# Altium schematic sheet RAM_DDR3_2RANK_BGA96.SchDoc
size A3
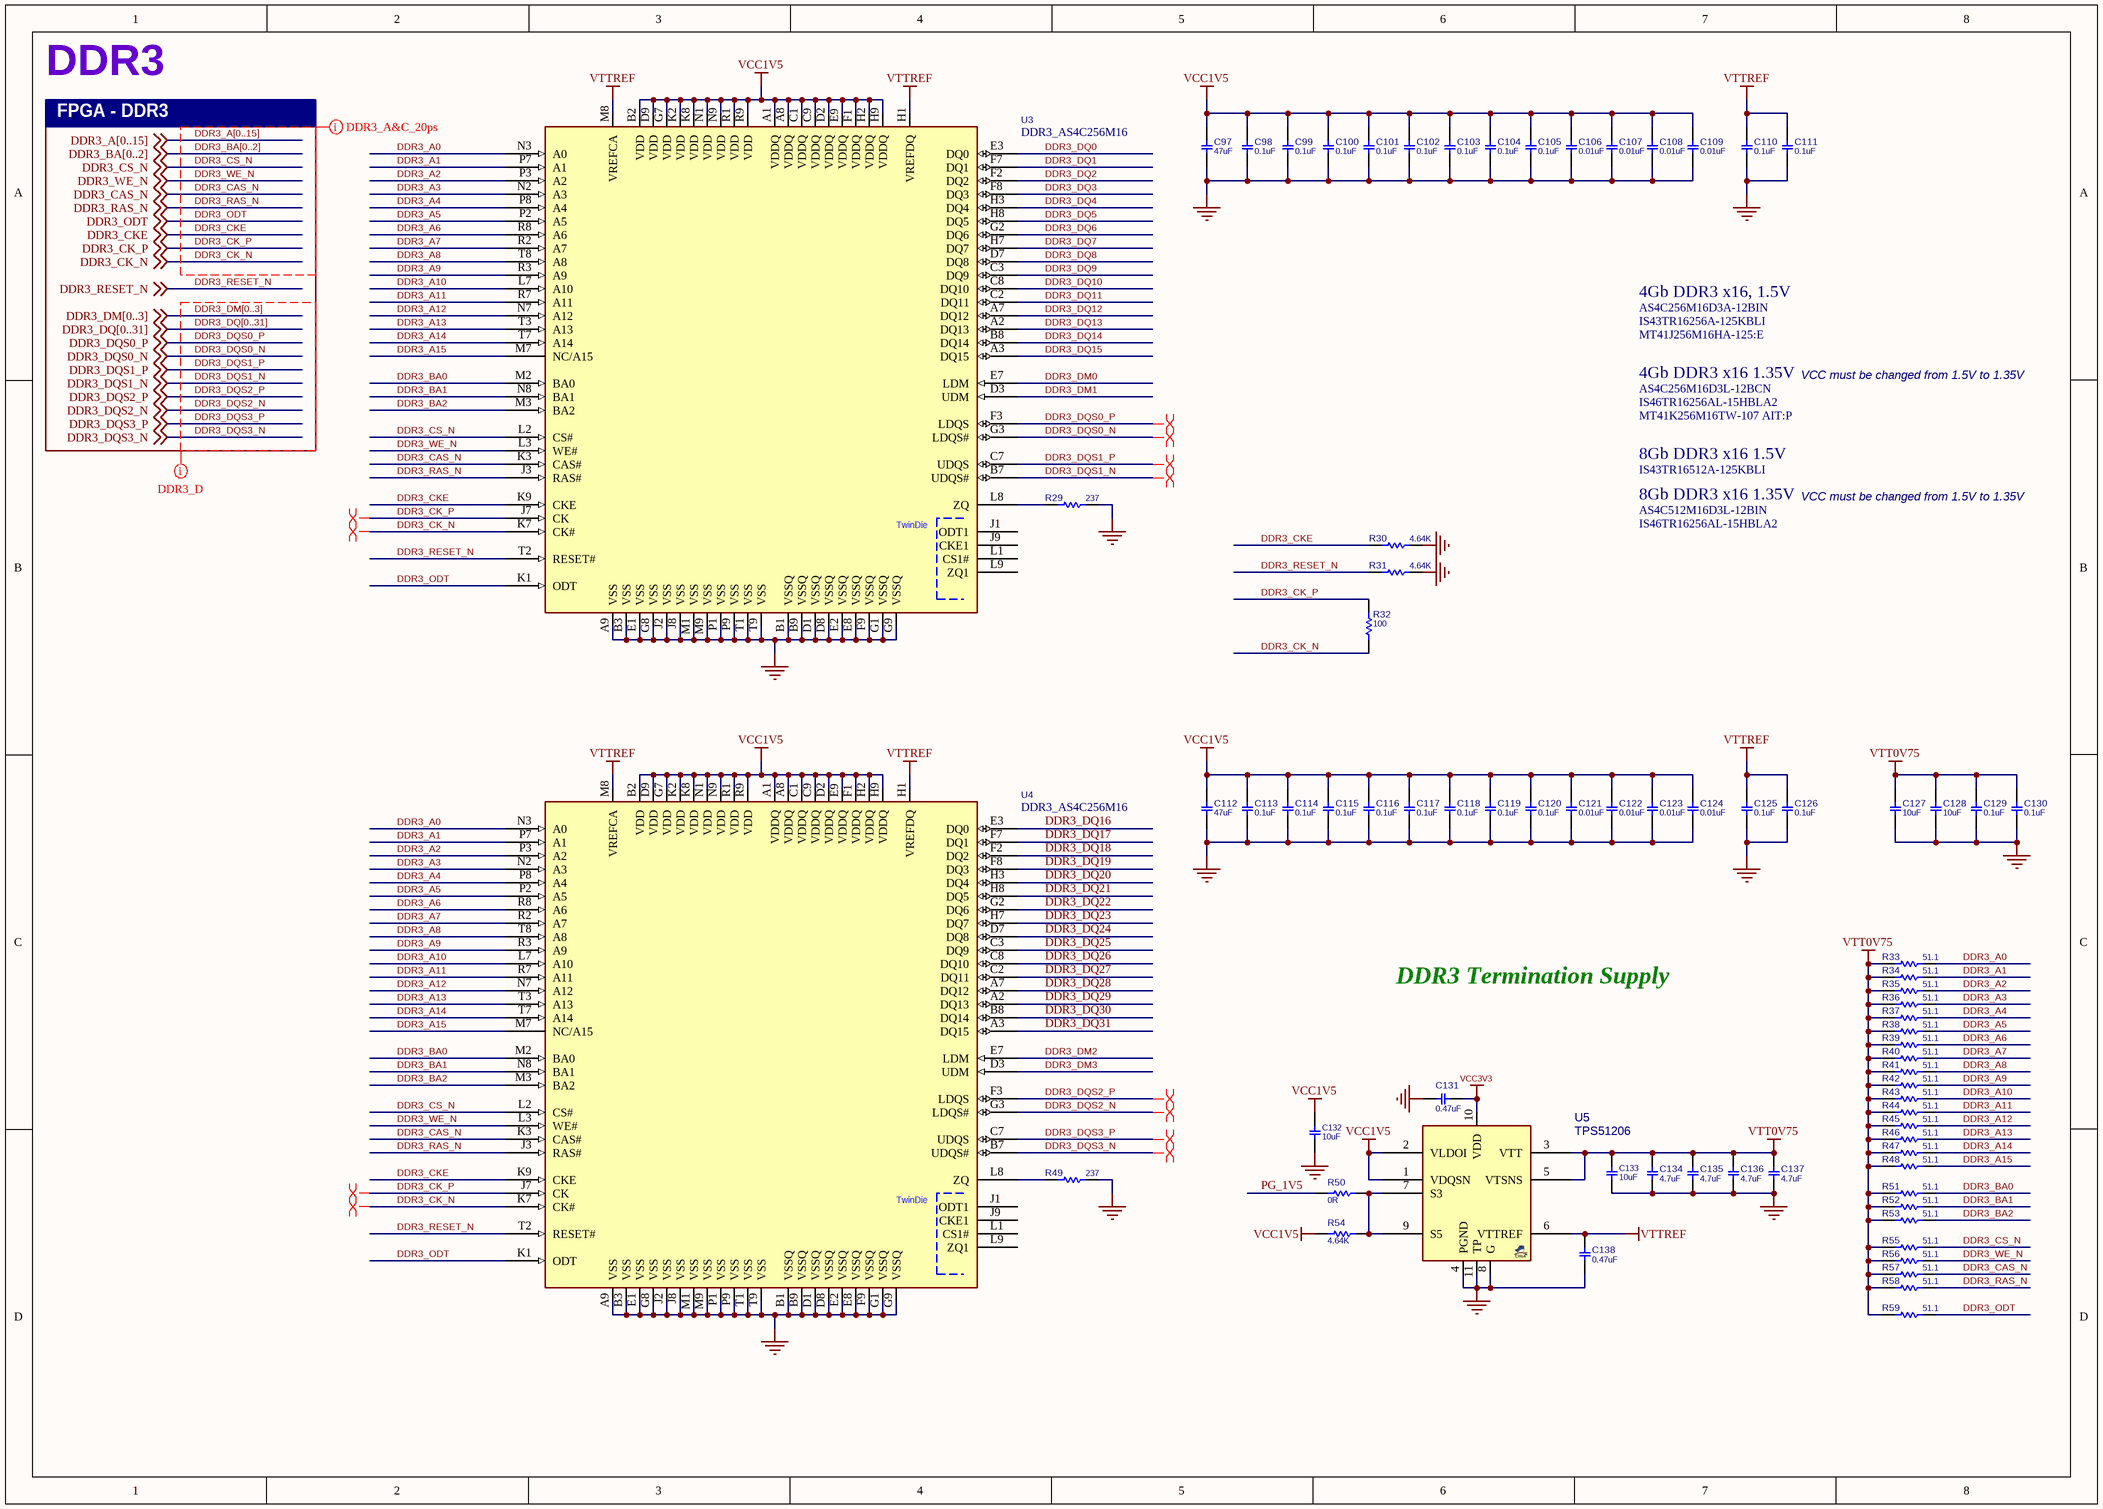
[diagram p0: RAM_DDR3_2RANK_BGA96.SchDoc]

## Parts
C97  47uF  [C0805]
C98  0.1uF  [C0402]
C99  0.1uF  [C0402]
C100  0.1uF  [C0402]
C101  0.1uF  [C0402]
C102  0.1uF  [C0402]
C103  0.1uF  [C0402]
C104  0.1uF  [C0402]
C105  0.1uF  [C0402]
C106  0.01uF  [C0402]
C107  0.01uF  [C0402]
C108  0.01uF  [C0402]
C109  0.01uF  [C0402]
C110  0.1uF  [C0402]
C111  0.1uF  [C0402]
C112  47uF  [C0805]
C113  0.1uF  [C0402]
C114  0.1uF  [C0402]
C115  0.1uF  [C0402]
C116  0.1uF  [C0402]
C117  0.1uF  [C0402]
C118  0.1uF  [C0402]
C119  0.1uF  [C0402]
C120  0.1uF  [C0402]
C121  0.01uF  [C0402]
C122  0.01uF  [C0402]
C123  0.01uF  [C0402]
C124  0.01uF  [C0402]
C125  0.1uF  [C0402]
C126  0.1uF  [C0402]
C127  10uF  [C0603]
C128  10uF  [C0603]
C129  0.1uF  [C0402A]
C130  0.1uF  [C0402A]
C131  0.47uF  [C0402]
C132  10uF  [C0603]
C133  10uF  [C0603]
C134  4.7uF  [C0603]
C135  4.7uF  [C0603]
C136  4.7uF  [C0603]
C137  4.7uF  [C0603]
C138  0.47uF  [C0402]
R29  237  [R0402]
R30  4.64K  [R0402]
R31  4.64K  [R0402]
R32  100  [R0402A]
R33  51.1  [R0402A]
R34  51.1  [R0402A]
R35  51.1  [R0402A]
R36  51.1  [R0402A]
R37  51.1  [R0402A]
R38  51.1  [R0402A]
R39  51.1  [R0402A]
R40  51.1  [R0402A]
R41  51.1  [R0402A]
R42  51.1  [R0402A]
R43  51.1  [R0402A]
R44  51.1  [R0402A]
R45  51.1  [R0402A]
R46  51.1  [R0402A]
R47  51.1  [R0402A]
R48  51.1  [R0402A]
R49  237  [R0402]
R50  0R  [R0402]
R51  51.1  [R0402A]
R52  51.1  [R0402A]
R53  51.1  [R0402A]
R54  4.64K  [R0402]
R55  51.1  [R0402A]
R56  51.1  [R0402A]
R57  51.1  [R0402A]
R58  51.1  [R0402A]
R59  51.1  [R0402A]
U3  DDR3_AS4C256M16  [BGA80_96_9X16B]
U4  DDR3_AS4C256M16  [BGA80_96_9X16B]
U5  TPS51206  [SON40_10T_2020]

## Nets
GND: C97.1 C98.1 C99.1 C100.1 C101.1 C102.1 C103.1 C104.1 C105.1 C106.1 C107.1 C108.1 C109.1 C110.1 C111.1 C112.1 C113.1 C114.1 C115.1 C116.1 C117.1 C118.1 C119.1 C120.1 C121.1 C122.1 C123.1 C124.1 C125.1 C126.1 C127.1 C128.1 C129.1 C130.1 C131.2 C132.1 C133.1 C134.2 C135.2 C136.2 C137.2 C138.2 R29.2 R30.2 R31.2 R49.2 U3.A9(VSS) U3.B1(VSSQ) U3.B3(VSS) U3.B9(VSSQ) U3.D1(VSSQ) U3.D8(VSSQ) U3.E1(VSS) U3.E2(VSSQ) U3.E8(VSSQ) U3.F9(VSSQ) U3.G1(VSSQ) U3.G8(VSS) U3.G9(VSSQ) U3.J2(VSS) U3.J8(VSS) U3.M1(VSS) U3.M9(VSS) U3.P1(VSS) U3.P9(VSS) U3.T1(VSS) U3.T9(VSS) U4.A9(VSS) U4.B1(VSSQ) U4.B3(VSS) U4.B9(VSSQ) U4.D1(VSSQ) U4.D8(VSSQ) U4.E1(VSS) U4.E2(VSSQ) U4.E8(VSSQ) U4.F9(VSSQ) U4.G1(VSSQ) U4.G8(VSS) U4.G9(VSSQ) U4.J2(VSS) U4.J8(VSS) U4.M1(VSS) U4.M9(VSS) U4.P1(VSS) U4.P9(VSS) U4.T1(VSS) U4.T9(VSS) U5.4(PGND) U5.8(G) U5.11(TP)
VCC1V5: C97.2 C98.2 C99.2 C100.2 C101.2 C102.2 C103.2 C104.2 C105.2 C106.2 C107.2 C108.2 C109.2 C112.2 C113.2 C114.2 C115.2 C116.2 C117.2 C118.2 C119.2 C120.2 C121.2 C122.2 C123.2 C124.2 C132.2 R54.1 U3.A1(VDDQ) U3.A8(VDDQ) U3.B2(VDD) U3.C1(VDDQ) U3.C9(VDDQ) U3.D2(VDDQ) U3.D9(VDD) U3.E9(VDDQ) U3.F1(VDDQ) U3.G7(VDD) U3.H2(VDDQ) U3.H9(VDDQ) U3.K2(VDD) U3.K8(VDD) U3.N1(VDD) U3.N9(VDD) U3.R1(VDD) U3.R9(VDD) U4.A1(VDDQ) U4.A8(VDDQ) U4.B2(VDD) U4.C1(VDDQ) U4.C9(VDDQ) U4.D2(VDDQ) U4.D9(VDD) U4.E9(VDDQ) U4.F1(VDDQ) U4.G7(VDD) U4.H2(VDDQ) U4.H9(VDDQ) U4.K2(VDD) U4.K8(VDD) U4.N1(VDD) U4.N9(VDD) U4.R1(VDD) U4.R9(VDD) U5.1(VDQSN) U5.2(VLDOI)
VCC3V3: C131.1 U5.10(VDD)
VTT0V75: C127.2 C128.2 C129.2 C130.2 C133.2 C134.1 C135.1 C136.1 C137.1 R33.1 R34.1 R35.1 R36.1 R37.1 R38.1 R39.1 R40.1 R41.1 R42.1 R43.1 R44.1 R45.1 R46.1 R47.1 R48.1 R51.1 R52.1 R53.1 R55.1 R56.1 R57.1 R58.1 R59.1 U5.3(VTT) U5.5(VTSNS)
VTTREF: C110.2 C111.2 C125.2 C126.2 C138.1 U3.H1(VREFDQ) U3.M8(VREFCA) U4.H1(VREFDQ) U4.M8(VREFCA) U5.6(VTTREF)
DDR3_A0: R33.2 U3.N3(A0) U4.N3(A0)
DDR3_A1: R34.2 U3.P7(A1) U4.P7(A1)
DDR3_A2: R35.2 U3.P3(A2) U4.P3(A2)
DDR3_A3: R36.2 U3.N2(A3) U4.N2(A3)
DDR3_A4: R37.2 U3.P8(A4) U4.P8(A4)
DDR3_A5: R38.2 U3.P2(A5) U4.P2(A5)
DDR3_A6: R39.2 U3.R8(A6) U4.R8(A6)
DDR3_A7: R40.2 U3.R2(A7) U4.R2(A7)
DDR3_A8: R41.2 U3.T8(A8) U4.T8(A8)
DDR3_A9: R42.2 U3.R3(A9) U4.R3(A9)
DDR3_A10: R43.2 U3.L7(A10) U4.L7(A10)
DDR3_A11: R44.2 U3.R7(A11) U4.R7(A11)
DDR3_A12: R45.2 U3.N7(A12) U4.N7(A12)
DDR3_A13: R46.2 U3.T3(A13) U4.T3(A13)
DDR3_A14: R47.2 U3.T7(A14) U4.T7(A14)
DDR3_A15: R48.2 U3.M7(NC/A15) U4.M7(NC/A15)
DDR3_BA0: R51.2 U3.M2(BA0) U4.M2(BA0)
DDR3_BA1: R52.2 U3.N8(BA1) U4.N8(BA1)
DDR3_BA2: R53.2 U3.M3(BA2) U4.M3(BA2)
DDR3_CAS_N: R57.2 U3.K3(CAS#) U4.K3(CAS#) ; off-sheet DDR3_CAS_N
DDR3_CK_N: R32.1 U3.K7(CK#) U4.K7(CK#) ; off-sheet DDR3_CK_N
DDR3_CK_P: R32.2 U3.J7(CK) U4.J7(CK) ; off-sheet DDR3_CK_P
DDR3_CKE: R30.1 U3.K9(CKE) U4.K9(CKE) ; off-sheet DDR3_CKE
DDR3_CS_N: R55.2 U3.L2(CS#) U4.L2(CS#) ; off-sheet DDR3_CS_N
DDR3_DM0: U3.E7(LDM)
DDR3_DM1: U3.D3(UDM)
DDR3_DM2: U4.E7(LDM)
DDR3_DM3: U4.D3(UDM)
DDR3_DQ0: U3.E3(DQ0)
DDR3_DQ1: U3.F7(DQ1)
DDR3_DQ2: U3.F2(DQ2)
DDR3_DQ3: U3.F8(DQ3)
DDR3_DQ4: U3.H3(DQ4)
DDR3_DQ5: U3.H8(DQ5)
DDR3_DQ6: U3.G2(DQ6)
DDR3_DQ7: U3.H7(DQ7)
DDR3_DQ8: U3.D7(DQ8)
DDR3_DQ9: U3.C3(DQ9)
DDR3_DQ10: U3.C8(DQ10)
DDR3_DQ11: U3.C2(DQ11)
DDR3_DQ12: U3.A7(DQ12)
DDR3_DQ13: U3.A2(DQ13)
DDR3_DQ14: U3.B8(DQ14)
DDR3_DQ15: U3.A3(DQ15)
DDR3_DQ16: U4.E3(DQ0)
DDR3_DQ17: U4.F7(DQ1)
DDR3_DQ18: U4.F2(DQ2)
DDR3_DQ19: U4.F8(DQ3)
DDR3_DQ20: U4.H3(DQ4)
DDR3_DQ21: U4.H8(DQ5)
DDR3_DQ22: U4.G2(DQ6)
DDR3_DQ23: U4.H7(DQ7)
DDR3_DQ24: U4.D7(DQ8)
DDR3_DQ25: U4.C3(DQ9)
DDR3_DQ26: U4.C8(DQ10)
DDR3_DQ27: U4.C2(DQ11)
DDR3_DQ28: U4.A7(DQ12)
DDR3_DQ29: U4.A2(DQ13)
DDR3_DQ30: U4.B8(DQ14)
DDR3_DQ31: U4.A3(DQ15)
DDR3_DQS0_N: U3.G3(LDQS#) ; off-sheet DDR3_DQS0_N
DDR3_DQS0_P: U3.F3(LDQS) ; off-sheet DDR3_DQS0_P
DDR3_DQS1_N: U3.B7(UDQS#) ; off-sheet DDR3_DQS1_N
DDR3_DQS1_P: U3.C7(UDQS) ; off-sheet DDR3_DQS1_P
DDR3_DQS2_N: U4.G3(LDQS#) ; off-sheet DDR3_DQS2_N
DDR3_DQS2_P: U4.F3(LDQS) ; off-sheet DDR3_DQS2_P
DDR3_DQS3_N: U4.B7(UDQS#) ; off-sheet DDR3_DQS3_N
DDR3_DQS3_P: U4.C7(UDQS) ; off-sheet DDR3_DQS3_P
DDR3_ODT: R59.2 U3.K1(ODT) U4.K1(ODT) ; off-sheet DDR3_ODT
DDR3_RAS_N: R58.2 U3.J3(RAS#) U4.J3(RAS#) ; off-sheet DDR3_RAS_N
DDR3_RESET_N: R31.1 U3.T2(RESET#) U4.T2(RESET#) ; off-sheet DDR3_RESET_N
DDR3_WE_N: R56.2 U3.L3(WE#) U4.L3(WE#) ; off-sheet DDR3_WE_N
PG_1V5: R50.1
NetR29_1: R29.1 U3.L8(ZQ)
NetR49_1: R49.1 U4.L8(ZQ)
NetR50_2: R50.2 R54.2 U5.7(S3) U5.9(S5)

Not connected (* = marked no-connect by the designer): U3 J1(ODT1) J9(CKE1) L1(CS1#) L9(ZQ1); U4 J1(ODT1) J9(CKE1) L1(CS1#) L9(ZQ1)

## Buses and harness runs
bus DDR3_A[0..15]
bus DDR3_BA[0..2]
bus DDR3_DM[0..3]
bus DDR3_DQ[0..31]

## Layout directives
differential pair: DDR3_CK_N, DDR3_CK_P, DDR3_DQS0_N, DDR3_DQS0_P, DDR3_DQS1_N, DDR3_DQS1_P, DDR3_DQS2_N, DDR3_DQS2_P, DDR3_DQS3_N, DDR3_DQS3_P
net class DDR3_A&C: DDR3_A[0..15], DDR3_BA[0..2], DDR3_CAS_N, DDR3_CK_N, DDR3_CK_P, DDR3_CKE, DDR3_CS_N, DDR3_ODT, DDR3_RAS_N, DDR3_WE_N
net class DDR3_D: DDR3_DM[0..3], DDR3_DQ[0..31], DDR3_DQS0_N, DDR3_DQS0_P, DDR3_DQS1_N, DDR3_DQS1_P, DDR3_DQS2_N, DDR3_DQS2_P, DDR3_DQS3_N, DDR3_DQS3_P

## Notes on the sheet
- DDR3
- FPGA - DDR3
- 4Gb DDR3 x16, 1.5V
- AS4C256M16D3A-12BIN
- MT41J256M16HA-125:E
- IS43TR16256A-125KBLI
- 4Gb DDR3 x16 1.35V
- VCC must be changed from 1.5V to 1.35V
- AS4C256M16D3L-12BCN
- IS46TR16256AL-15HBLA2
- MT41K256M16TW-107 AIT:P
- 8Gb DDR3 x16 1.35V
- AS4C512M16D3L-12BIN
- 8Gb DDR3 x16 1.5V
- IS43TR16512A-125KBLI
- DDR3 Termination Supply
- (in symbol DDR3_AS4C256M16_BGA96) TwinDie

## Library data of the parts
C97 C112 = CAP_SMD_MLCC_47u16V: CAP, MLCC, X5R 47uF 16V 10% 1210; MANF: Murata; PARAM2: X5R, 10%; MANF_P#: GRM32ER61C476KE15K; PARAM: 16V; PRICE: 100= 47$; VALUE: 47uF
C98-C105 C110 C111 C113-C120 C125 C126 C129 C130 = CAP_SMD_MLCC_100n50T: CAP, MLCC, 100nF, 50V, X7R, 10%, 0402C; MANF: Taiyo Yuden; MANF_P#: UMK105B7104KVHF; PARAM: 50V; DESC: CAP, MLCC, 100nF, 50V, X7R, 10%, 0402C; PARAM2: X7R, 10%; ASSEMBLY: ASSEMBLY; VALUE: 0.1uF; PRICE: 100= 5$
C106-C109 C121-C124 = CAP_SMD_MLCC_10n50V: CAP, MLCC, 10nF, 50V, X7R, 10%, 0402C; MANF: Murata; MANF_P#: GCM155R71H103KA55D; DIST#: MOUSER/81-GCM155R71H103KA5D; PARAM: 50V; PARAM2: X7R, 10%; DESC: CAP, MLCC, 10nF, 50V, X7R, 10%, 0402C; VALUE: 0.01uF; ASSEMBLY: ASSEMBLY; PRICE: 100= 0.8$
C127 C128 = CAP_SMD_MLCC_10u16V: CAP, MLCC, 10uF, 16V, X6S, 20%, 0603; MANF: Murata; PARAM2: X5R, 10%; DESC: CAP, MLCC, 10uF, 16V, X5R, 10%, 0603; MANF_P#: GRM188R61C106KAALD; PARAM: 16V; VALUE: 10uF; ASSEMBLY: ASSEMBLY
C131 C134-C138 = CAP_SMD_MLCC_100n50V: CAP, MLCC, 100nF, 50V, X7S, 5%, 0402C; MANF_PART#: GRM155C71H104JE19D; MANF: Murata; PARAM2: X7R, 10%; PARAM: 50V; DESC: CAP, MLCC, 100nF, 50V, X7S, 5%, 0402C; ASSEMBLY: ASSEMBLY; PRICE: 100= 2$
  C131 C138: VALUE: 0.47uF
  C134-C137: VALUE: 4.7uF
C132 C133 = CAP_SMD_MLCC_10u25V: CAP, MLCC, X5R 10uF 10% 25V 0805; MANF: Taiyo Yuden; PARAM2: X5R, 10%; MANF_P#: TMK212BBJ106MG-T; PARAM: 25V; VALUE: 10uF; PRICE: 100=5$
R29 R49 = RES_SMD: RESISTOR, SMD; MANF: KOA SPEER; PARAM: 0.063W; DESC: DESCRIPTION; DIST#: MOUSER; PARAM2: 1%; MANF_P#: RK73H1ETTP2400F; ASSEMBLY: ASSEMBLY; PRICE: 100= 0.5$; VALUE: 237
R30 R31 R33-R48 R51-R53 R55-R59 = RES_SMD: RESISTOR, SMD; MANF: Yageo; PARAM: 0.063W; DESC: DESCRIPTION; DIST#: MOUSER; PARAM2: 1%; MANF_P#: RC0402FR-074K7L; ASSEMBLY: ASSEMBLY; PRICE: 100= 0.3$
  R30 R31: VALUE: 4.64K
  R33-R48 R51-R53 R55-R59: VALUE: 51.1
R32 = RES_SMD: RESISTOR, SMD; MANF: Yageo; PARAM: 0.063W; DESC: DESCRIPTION; DIST#: MOUSER; PARAM2: 1%; MANF_P#: RC0402FR-13100RL; ASSEMBLY: ASSEMBLY; PRICE: 100= 0.3$; VALUE: 100
R50 R54 = RES_SMD: RESISTOR, SMD, 10K, 1%, 0402; MANF: KOA SPEER; PARAM: 0.063W; DIST#: MOUSER; MANF_P#: RK73H1ETTP1002F; ASSEMBLY: ASSEMBLY; PRICE: 100= 0.5$; DESC: RESISTOR, SMD, 10K, 1%, 0402; PARAM2: 1%
  R50: VALUE: 0R
  R54: VALUE: 4.64K
U3 U4 = DDR3_AS4C256M16_BGA96: DDR3L SDRAM, 4Gb (256Mb X16), 1.5V, FBGA-96; MANF: ALLIANCE MEMORY; PARAM: 4Gb (256Mb X16), 800MHz; DESC: AS4C256M16D3A-12BAN; MANF_P#: AS4C256M16D3A-12BIN; PARAM2: 1.5V, -40~95oC; VALUE: DDR3_AS4C256M16; ASSEMBLY: ASSEMBLY; PRICE: 10.9$
U5 = VREG_TPS51206_SON10: REG, Linear, LDO, 2A Sink/Source DDR Termination, SON-10; MANF: TI; DESC: REG, Linear, LDO, 3A Sink/Source DDR Termination, SON-10; PARAM2: 3.3/5Vcc,; MANF_P#: TPS51206DSQ; ASSEMBLY: ASSEMBLY; PARAM: 2A; PRICE: -; VALUE: TPS51206